# EasyEDA Pro project ProPrj_CWATCH_2025-07-30.epro, schematic Schematic3
Board Name: Board3; Create Date: 2025-07-22; Page Name: P1; Project Name: CWATCH; Schematic Name: Schematic3; Update Date: 2025-07-23; Company: EasyEDA.com; Page Size: A4; Version: V1.0
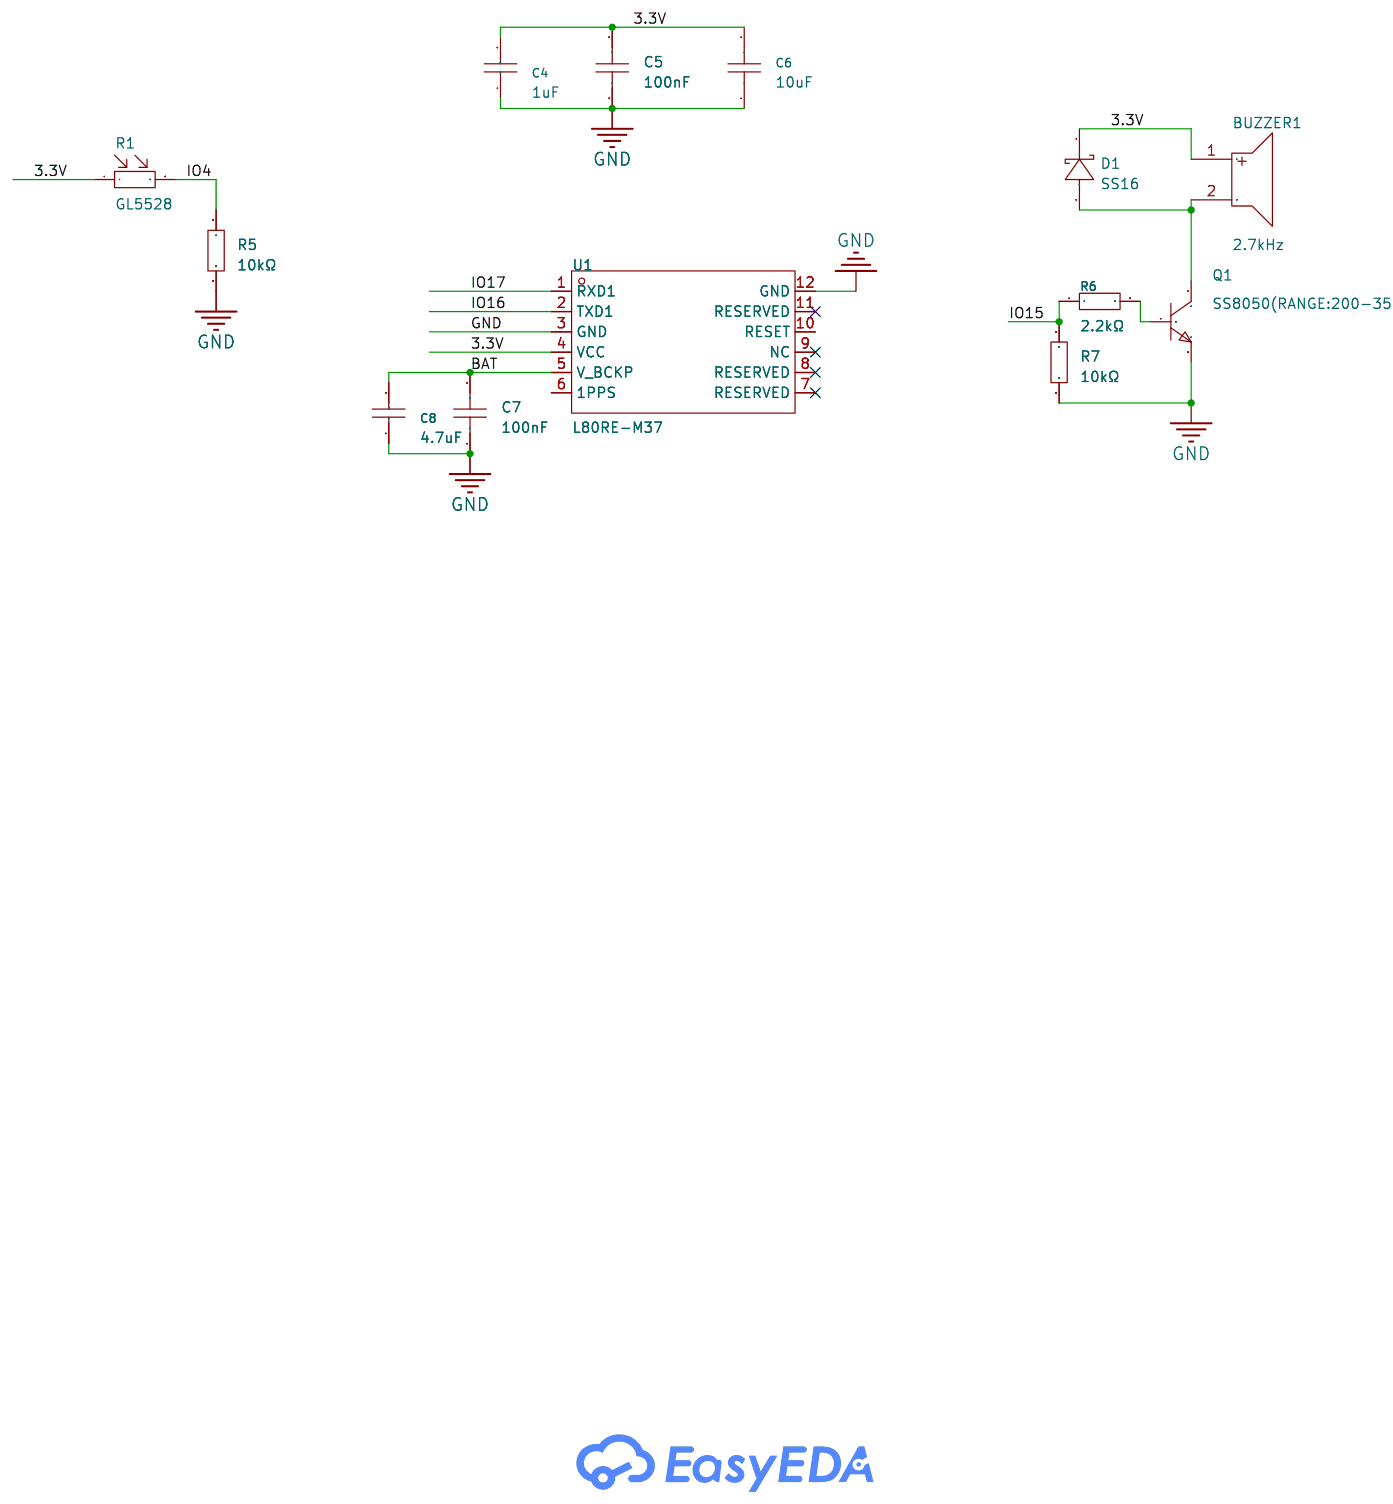
[diagram p0: schematic sheet]

## Parts
BUZZER1  2.7kHz  [BUZ-TH_BD9.0-P4.00-D0.6-FD]
C4  1uF  [C0402]
C5  100nF  [C0402]
C6  10uF  [C0603]
C7  100nF  [C0402]
C8  4.7uF  [C0402]
D1  SS16  [SMA_L4.3-W2.6-LS5.0-RD]
Q1  SS8050(RANGE:200-350)  [SOT-23-3_L2.9-W1.3-P1.90-LS2.4-BR]
R1  GL5528  [RES-TH_L5.1-W4.3-P3.40-D0.5]
R5  10kΩ  [R0402]
R6  2.2kΩ  [R0402]
R7  10kΩ  [R0402]
U1  L80RE-M37  [GPSM-SMD_12P-L16.0-W16.0-P2.54-BL]

## Library data of the parts
BUZZER1 = QMB-09B-03: Driver Circuitry:Passive (external drive) Technology:Electromagnetic Type Voltage - Supply:2V~5V Voltage - Supply:2V~5V Frequency:2.7kHz Sound Pressure Level(SPL):85dB Diameter(φD):9mm Height:5.7mm; LCSC Part Name: 无源蜂鸣器QMB-09B-03; Supplier Part: C96256; Manufacturer: 华能; Supplier Footprint: 插件,D=9mm; JLCPCB Part Class: Extended Part; Datasheet: https://atta.szlcsc.com/upload/public/pdf/source/20210401/C96256_958B17753B5AD7CBFBCFFC7C095B4484.pdf; Supplier: LCSC; Driver Circuitry: Passive (external drive); Technology: Electromagnetic Type; Voltage - Supply: 2V~5V; Sound Pressure Level(SPL): 85dB; Diameter(φD): 9mm; Height: 5.7mm
C4 = CL05A105KP5NNNC: Capacitance: Tolerance:±10% Tolerance:±10% Voltage Rated: Temperature Coefficient:; LCSC Part Name: 1uF ±10% 10V; Supplier Part: C14445; Manufacturer: SAMSUNG(三星); Supplier Footprint: 0402; JLCPCB Part Class: Extended Part; Datasheet: https://atta.szlcsc.com/upload/public/pdf/source/20160218/1457707763339.pdf; Supplier: LCSC; Tolerance: ±10%
C5 C7 = CL05B104KB54PNC: Capacitance: Tolerance:±10% Tolerance:±10% Voltage Rated: Temperature Coefficient:; LCSC Part Name: 100nF ±10% 50V; Supplier Part: C307331; Manufacturer: SAMSUNG(三星); Supplier Footprint: 0402; JLCPCB Part Class: Basic Part; Datasheet: https://atta.szlcsc.com/upload/public/pdf/source/20160218/1457707763339.pdf; Supplier: LCSC; Tolerance: ±10%
C6 = CL10A106MA8NRNC: Capacitance: Tolerance:±20% Tolerance:±20% Voltage Rated: Temperature Coefficient:; LCSC Part Name: 10uF ±20% 25V; Supplier Part: C96446; Manufacturer: SAMSUNG(三星); Supplier Footprint: 0603; JLCPCB Part Class: Basic Part; Datasheet: https://atta.szlcsc.com/upload/public/pdf/source/20160218/1457707763339.pdf; Supplier: LCSC; Tolerance: ±20%
C8 = CL05A475MP5NRNC: Capacitance: Tolerance:±20% Tolerance:±20% Voltage Rated: Temperature Coefficient:; LCSC Part Name: 4.7uF ±20% 10V; Supplier Part: C23733; Manufacturer: SAMSUNG(三星); Supplier Footprint: 0402; JLCPCB Part Class: Basic Part; Datasheet: https://atta.szlcsc.com/upload/public/pdf/source/20160218/1457707763339.pdf; Supplier: LCSC; Tolerance: ±20%
D1 = SS16_C18199176: Diode Configuration:Independent Type Forward Voltage (Vf@If):700mV@1A Reverse Voltage (Vr):60V Rectified Current:1A Reverse Leakage Current (Ir):200uA@60V; LCSC Part Name: 电压:60V 电流:1A; Supplier Part: C18199176; Manufacturer: 宏迦橙; Supplier Footprint: SMA(DO-214AC); JLCPCB Part Class: Extended Part; Datasheet: https://atta.szlcsc.com/upload/public/pdf/source/20230828/C73881E3299A0827586C2B1C18B17A53.pdf; Supplier: LCSC; Diode Configuration: Independent Type; Forward Voltage (Vf@If): 700mV@1A; Reverse Voltage (Vr): 60V; Rectified Current: 1A; Reverse Leakage Current (Ir): 200uA@60V
Q1 = SS8050(RANGE:200-350)_C2150: Transistor Type: Collector Current (Ic): Collector-Emitter Breakdown Voltage (Vceo): Power Dissipation (Pd): DC Current Gain (hFE@Ic,Vce):200@800mA,1V DC Current Gain (hFE@Ic,Vce):200@800mA,1V Transition Frequency (fT):100MHz Collector Cut-Off Current (Ic; LCSC Part Name: NPN 电流:1.5A 耐压:25V hfe=200~350; Supplier Part: C2150; Manufacturer: CJ(江苏长电/长晶); Supplier Footprint: SOT-23; JLCPCB Part Class: Basic Part; Datasheet: https://atta.szlcsc.com/upload/public/pdf/source/20230322/AEE86F4B043774EFF80CAEA14A37D9E9.pdf; Supplier: LCSC; DC Current Gain (hFE@Ic,Vce): 200@800mA,1V; Transition Frequency (fT): 100MHz; Collector Cut-Off Current (Icbo): 100nA; Collector-Emitter Saturation Voltage (VCE(sat)@Ic,Ib): 500mV@800mA,80mA; Operating Temperature: -55℃~+150℃
R1 = GL5528: Dark Resistance: Cell Resistance @ Illuminance:8kΩ~20kΩ Cell Resistance @ Illuminance:8kΩ~20kΩ Voltage - Max:150V Wavelength - Peak:; Supplier Part: C125627; Manufacturer: 森霸; Supplier Footprint: 插件,P=3mm; JLCPCB Part Class: Extended Part; Datasheet: https://atta.szlcsc.com/upload/public/pdf/source/20230427/842A99E3D53A83729D7968886D4EFCBB.pdf; Supplier: LCSC; Cell Resistance @ Illuminance: 8kΩ~20kΩ; Voltage - Max: 150V
R5 R7 = 0402WGF1002TCE: Type:Thick Film Resistors Resistance:10kΩ Tolerance:±1% Tolerance:±1% Power(Watts): Overload Voltage (Max): Temperature Coefficient:±100ppm/℃ Temperature Coefficient:±100ppm/℃ Operating Temperature Range:-55℃~+155℃ Operating Temperature Range:-55℃~+155℃; LCSC Part Name: 10kΩ ±1% 62.5mW 厚膜电阻; Supplier Part: C25744; Manufacturer: UNI-ROYAL(厚声); Supplier Footprint: 0402; JLCPCB Part Class: Basic Part; Datasheet: https://atta.szlcsc.com/upload/public/pdf/source/20200306/C422600_1E6D84923E4A46A82E41ADD87F860B5C.pdf; Supplier: LCSC; Type: Thick Film Resistors; Tolerance: ±1%; Temperature Coefficient: ±100ppm/℃; Operating Temperature Range: -55℃~+155℃
R6 = 0402WGF2201TCE: Type:Thick Film Resistors Resistance:2.2kΩ Tolerance:±1% Tolerance:±1% Power(Watts): Overload Voltage (Max): Temperature Coefficient:±100ppm/℃ Temperature Coefficient:±100ppm/℃ Operating Temperature Range:-55℃~+155℃ Operating Temperature Range:-55℃~+155℃; LCSC Part Name: 2.2kΩ ±1% 62.5mW 厚膜电阻; Supplier Part: C25879; Manufacturer: UNI-ROYAL(厚声); Supplier Footprint: 0402; JLCPCB Part Class: Basic Part; Datasheet: https://atta.szlcsc.com/upload/public/pdf/source/20200306/C422600_1E6D84923E4A46A82E41ADD87F860B5C.pdf; Supplier: LCSC; Type: Thick Film Resistors; Tolerance: ±1%; Temperature Coefficient: ±100ppm/℃; Operating Temperature Range: -55℃~+155℃
U1 = L80RE-M37: Operating Supply Voltage:3V~4.3V Operating Supply Voltage:3V~4.3V Sensitivity:-165dBm Sensitivity:-165dBm Operating Temperature:-40℃~+85℃ Operating Temperature:-40℃~+85℃; LCSC Part Name: GPS模块; Supplier Part: C3029061; Manufacturer: Quectel(移远); Supplier Footprint: SMD-12P; JLCPCB Part Class: Extended Part; Datasheet: https://atta.szlcsc.com/upload/public/pdf/source/20220527/3A05E11B37A3891E2217B4B1159372B8.pdf; Supplier: LCSC; Operating Supply Voltage: 3V~4.3V; Sensitivity: -165dBm; Operating Temperature: -40℃~+85℃

## Nets
3.3V: BUZZER1.1 C4.2 C5.2 C6.2 D1.1(K) R1.1 U1.4(VCC)
GND: C4.1 C5.1 C6.1 C7.1 C8.1 Q1.2(E) R5.2 R7.2 U1.3(GND) U1.12(GND)
BAT: C7.2 C8.2 U1.5(V_BCKP)
IO4: R1.2 R5.1
IO15: R6.1 R7.1
IO16: U1.2(TXD1)
IO17: U1.1(RXD1)
$1N970: BUZZER1.2 D1.2(A) Q1.3(C)
$1N1589: Q1.1(B) R6.2

Not connected (* = marked no-connect by the designer): U1 6(1PPS) 7(RESERVED)* 8(RESERVED)* 9(NC)* 10(RESET) 11(RESERVED)*
